# Altium schematic sheet 16_BoardPowerSupplyBattery.SchDoc: BoardPowerSupplyBattery
size A3; Author: NeoExiZ; CompanyName: BUPT CPS Lab; Organization: NeoExiZ; Address1: 418, 4#Building, BUPT; Address2: No.10, Xitucheng Road; Address3: Beijing; Address4: China; Revision: vN0.1; SheetNumber: 1; SheetTotal: 2
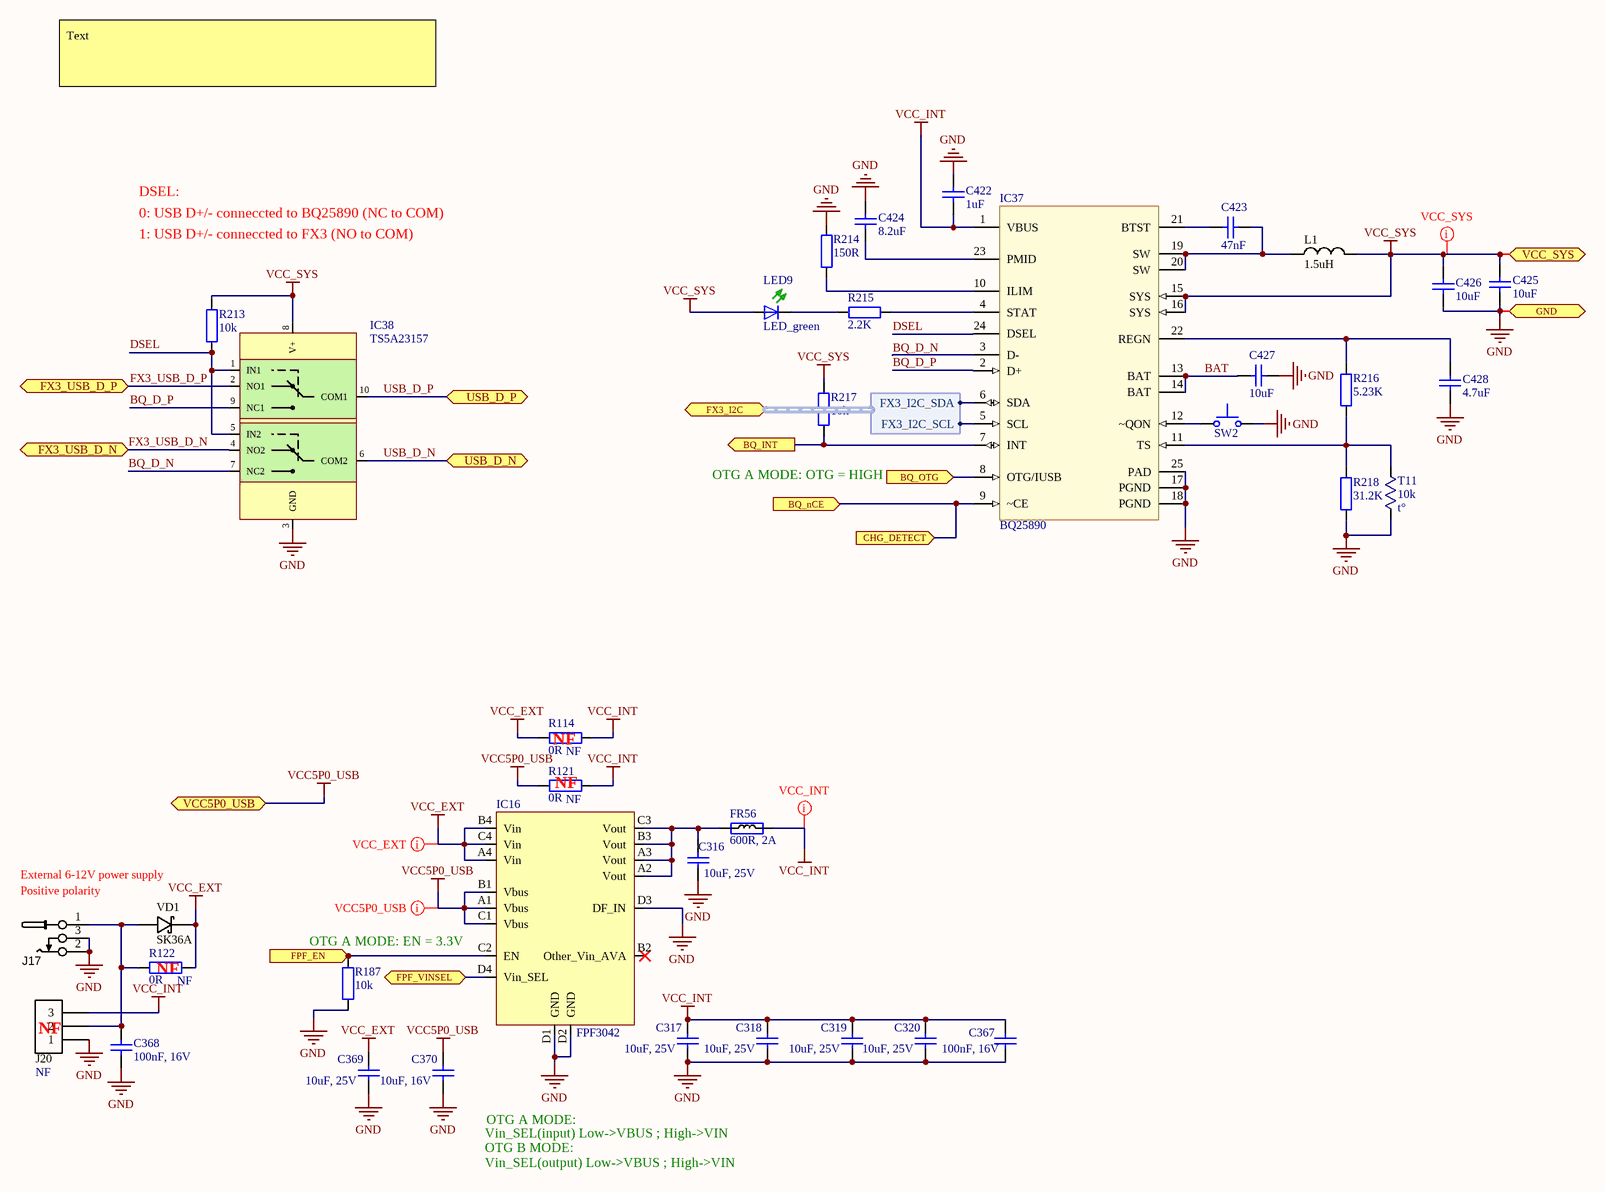
[diagram p0: 16_BoardPowerSupplyBattery.SchDoc]

## Parts
C316  10uF, 25V  [CAP0603]
C317  10uF, 25V  [CAP0603]
C318  10uF, 25V  [CAP0603]
C319  10uF, 25V  [CAP0603]
C320  10uF, 25V  [CAP0603]
C367  100nF, 16V  [CAP0402]
C368  100nF, 16V  [CAP0402]
C369  10uF, 25V  [CAP0603]
C370  10uF, 16V  [CAP0603]
C422  1uF  [CAP0402]
C423  47nF  [CAP0402]
C424  8.2uF  [CAP0402]
C425  10uF  [CAP0603]
C426  10uF  [CAP0603]
C427  10uF  [CAP0402]
C428  4.7uF  [CAP0603]
FR56  600R, 2A  [RES0805]
IC16  FPF3042  [FPF3042]
IC37  BQ25890  [WQFN-24]
IC38  TS5A23157  [TS5A23157]
J17  CONN_PWR_JACK_2.1x5.5mm  [CONN_PWR_JACK_v4]  (value not drawn)
J20  Assembly Info: NF  [HDR_1x3]  (hidden comment: Header 3x1 pin)
L1  1.5uH  [FDVE1040_TOKO_INDUCTOR]
LED9  LED_green  [LED-0603-GREEN]
R114  0R  Assembly Info: NF  [RES0402]
R121  0R  Assembly Info: NF  [RES0402]
R122  0R  Assembly Info: NF  [RES0805]
R187  10k  [RES0402]
R213  10k  [RES0402]
R214  150R  [RES0402]
R215  2.2K  [RES0402]
R216  5.23K  [RES0402]
R217  10k  [RES0402]
R218  31.2K  [RES0402]
SW2  Switch, tactile  [SW_tactile]  (value not drawn)
T11  10k  symbol: t°  [AT-2]
VD1  SK36A  [DIODE_SMB]

## Ports
BQ_INT (out), BQ_nCE (in), BQ_OTG (in), CHG_DETECT (in), FPF_EN (in), FPF_VINSEL (bidir), FX3_I2C (harness FX3_I2C), FX3_USB_D_N (bidir), FX3_USB_D_P (bidir), GND, USB_D_N (bidir), USB_D_P (bidir), VCC5P0_USB, VCC_SYS

## Harnesses
FX3_I2C: FX3_I2C_SCL, FX3_I2C_SDA

## Nets
GND: C316.1 C317.1 C318.1 C319.1 C320.1 C367.2 C368.2 C369.1 C370.1 C422.2 C424.2 C425.1 C426.1 C427.2 C428.1 IC16.D1(GND) IC16.D2(GND) IC16.D3(DF_IN) IC37.17(PGND) IC37.18(PGND) IC37.25(PAD) IC38.3(GND) J17.2 J17.3 J20.1 R187.1 R214.1 R218.1 SW2.2 T11.1 ; port GND
VCC5P0_USB: C370.2 IC16.A1(Vbus) IC16.B1(Vbus) IC16.C1(Vbus) R121.2 ; port VCC5P0_USB
VCC_EXT: C369.2 IC16.A4(Vin) IC16.B4(Vin) IC16.C4(Vin) R114.2 R122.1 VD1.K
VCC_INT: C317.2 C318.2 C319.2 C320.2 C367.1 C422.1 FR56.1 IC37.1(VBUS) J20.3 R114.1 R121.1
VCC_SYS: C425.2 C426.2 IC37.15(SYS) IC37.16(SYS) IC38.8(V+) L1.2 LED9.A R213.2 R217.2 ; port VCC_SYS
BAT: C427.1 IC37.13(BAT) IC37.14(BAT)
BQ_D_N: IC37.3(D-) IC38.7(NC2)
BQ_D_P: IC37.2(D+) IC38.9(NC1)
BQ_INT: IC37.7(INT) R217.1 ; port BQ_INT
BQ_nCE: IC37.9(~CE) ; port BQ_nCE, port CHG_DETECT
BQ_OTG: IC37.8(OTG/IUSB) ; port BQ_OTG
DSEL: IC37.24(DSEL) IC38.1(IN1) IC38.5(IN2) R213.1
FPF_EN: IC16.C2(EN) R187.2 ; port FPF_EN
FPF_VINSEL: IC16.D4(Vin_SEL) ; port FPF_VINSEL
FX3_USB_D_N: IC38.4(NO2) ; port FX3_USB_D_N
FX3_USB_D_P: IC38.2(NO1) ; port FX3_USB_D_P
USB_D_N: IC38.6(COM2) ; port USB_D_N
USB_D_P: IC38.10(COM1) ; port USB_D_P
NetC316_2: C316.2 FR56.2 IC16.A2(Vout) IC16.A3(Vout) IC16.B3(Vout) IC16.C3(Vout)
NetC368_1: C368.1 J17.1 J20.2 R122.2 VD1.A
NetC423_1: C423.1 IC37.21(BTST)
NetC423_2: C423.2 IC37.19(SW) IC37.20(SW) L1.1
NetC424_1: C424.1 IC37.23(PMID)
NetC428_2: C428.2 IC37.22(REGN) R216.2
NetIC37_4: IC37.4(STAT) R215.1
NetIC37_5: IC37.5(SCL) ; port FX3_I2C.FX3_I2C_SCL
NetIC37_6: IC37.6(SDA) ; port FX3_I2C.FX3_I2C_SDA
NetIC37_10: IC37.10(ILIM) R214.2
NetIC37_11: IC37.11(TS) R216.1 R218.2 T11.2
NetIC37_12: IC37.12(~QON) SW2.1
NetLED9_K: LED9.K(C) R215.2

Not connected (* = marked no-connect by the designer): IC16 B2(Other_Vin_AVA)*

## Layout directives
net class VCC_INT: VCC_INT
net class VCC_EXT: VCC_EXT
net class VCC5P0_USB: VCC5P0_USB
net class VCC_SYS: VCC_SYS

## Notes on the sheet
- Text
- DSEL:
- 1: USB D+/- conneccted to FX3 (NO to COM)
- 0: USB D+/- conneccted to BQ25890 (NC to COM)
- (near R217) OTG A MODE: OTG = HIGH
- (near R114) NF
- (near R121) NF
- External 6-12V power supply
- Positive polarity
- (near R187) OTG A MODE: EN = 3.3V
- (near R122) NF
- (near J20) NF
- Vin_SEL(input) Low->VBUS ; High->VIN
- OTG B MODE:
- OTG A MODE:
- Vin_SEL(output) Low->VBUS ; High->VIN
- Note:
- Project Name:
- Size:
- Date:
- Title:
- A3
- Revision:
- Time:
- Author:
- Sheet
- of
- File:

## Library data of the parts
C316-C320 C369 = Cap_0603: Manufacturer: Murata Electronics North America; Manufacturer Part Number: GRM188R61E106MA73D; Part Description: 10µF ±20% 25V X5R Ceramic Capacitor -55°C ~ 85°C Surface Mount, MLCC 0603 (1608 Metric) 0.063" L x 0.031" W (1.60mm x 0.80mm); Capacitance: 10µF; Tolerance: ±20%; Temperature Coefficient: X5R; Supplier 1: Digi-Key; Supplier Part Number 1: 490-7202-2-ND; Category: Capacitors; RoHS: RoHS Compliant; Packaging: Tape & Reel (TR); Voltage - Rated: 25V; Mounting Type: Surface Mount, MLCC; Operating Temperature: -55°C ~ 85°C; Applications: General Purpose; Ratings: -; Package / Case: 0603 (1608 Metric); Size / Dimension: 0.063" L x 0.031" W (1.60mm x 0.80mm); Height - Seated (Max): -; Thickness (Max): 0.031" (0.80mm); Lead Spacing: -; Features: -; Lead Style: -; value: 10uF, 25V
C367 C368 = Cap_0402: Manufacturer: Murata Electronics; Manufacturer Part Number: GRM155R71C104KA88D; Part Description: 0.10µF ±10% 16V X7R Ceramic Capacitor -55°C ~ 125°C Surface Mount, MLCC 0402 (1005 Metric) 0.039" L x 0.020" W (1.00mm x 0.50mm); Tolerance: 10 %; Type: General Purpose MLCC; Capacitance: 0.1 uF; Case Length: 1 mm; Dielectric: X7R; Case Height: 0.5 mm; Temperature Coefficient / Code: +/- 15 %; Value: 100nF, 16V; Supplier 1: Mouser; Supplier Part Number 1: 81-GRM155R71C104KA88; Case Code - in: 0402; RoHS: RoHS Compliant; Operating Temperature Range: - 55 C to + 125 C; Series: GRM; Termination Style: SMD/SMT; Package / Case: 0402 (1005 metric); Voltage Rating DC: 16 V; Maximum Operating Temperature: + 125 C; Case Code - mm: 1005; Minimum Operating Temperature: - 55 C; Product Category: Low & Medium Capacitance SMD Ceramic Chip Capacitors; Packaging: Reel; Product: General Type MLCCs; Category: Multilayer Ceramic Capacitors MLCC - SMD/SMT; Brand: Murata Electronics; Case Width: 0.5 mm; RoHS - Mouser: Y; Standard Pack Qty: 10000; Minimum Order Quantity: 1; Reeling: True; Manufacturer Part Number 1: GRM155R71C104KA88D
C370 = Cap_0603: Manufacturer: Yageo; Manufacturer Part Number 1: GRM188R61C106MA73D; Part Description: 10µF ±20% 16V X5R Ceramic Capacitor -55°C ~ 85°C Surface Mount, MLCC 0603 (1608 Metric) 0.063" L x 0.031" W (1.60mm x 0.80mm); Temperature Coefficient: X5R; Capacitance: 10µF; Tolerance: ±20%; Value: 10uF, 16V; Supplier 1: Digi-Key; Supplier Part Number 1: 490-7201-2-ND; Category: Capacitors; Ratings: -; Features: -; Lead Style: -; Package / Case: 0603 (1608 Metric); Lead Spacing: -; Applications: General Purpose; Voltage - Rated: 16V; Operating Temperature: -55°C ~ 85°C; Thickness (Max): 0.039" (1.00mm); Mounting Type: Surface Mount, MLCC; RoHS: RoHS Compliant; Size / Dimension: 0.063" L x 0.031" W (1.60mm x 0.80mm); Packaging: Tape & Reel (TR); Height - Seated (Max): -
C422-C424 C427 = Cap_0402: Value: *
C425 C426 C428 = Cap_0603
  C425 C426: Value: 10uF
  C428: Value: 4.7uF
FR56 = Ferrite: Manufacturer Part Number 1: MPZ2012S601AT000; Manufacturer: TDK Corporation; Part Description: FERRITE BEAD 600 OHM 0805 1LN; DC Resistance (DCR): 100 mOhm Max; Filter Type: Differential Mode - Single; Impedance @ Frequency: 600 Ohm @ 100MHz; Supplier 1: Digi-Key; Supplier Part Number 1: 445-2206-2-ND; Value: 600R, 2A; Category: Filters; Current Rating: 2A; Height (Max): 0.041" (1.05mm); Mounting Type: Surface Mount; Package / Case: 0805 (2012 Metric); Packaging: Tape & Reel (TR); RoHS: RoHS Compliant; Size / Dimension: 0.079" L x 0.049" W (2.00mm x 1.25mm)
IC16 = FPF3042: Manufacturer: Fairchild Semiconductor; Manufacturer Part Number 1: FPF3042UCX; Part Description: IC OR CTRLR SRC SELECT 16WLCSP; Current - Output (Max): 2.7A; Voltage - Supply: 4 V ~ 12.4 V; FET Type: N-Channel; Internal Switch(s): Yes; Current - Supply: 55µA; Ratio - Input:Output: 2:1; Supplier 1: Digi-Key; Operating Temperature: -40°C ~ 85°C; Type: Source Selector Switch; Delay Time - OFF: -; Package / Case: 16-UFBGA, WLCSP; Delay Time - ON: -; Mounting Type: Surface Mount; Applications: Handheld/Mobile Devices; Supplier Device Package: 16-WLCSP; Packaging: Cut Tape (CT); Category: Integrated Circuits (ICs); RoHS: RoHS Compliant; Supplier Part Number 1: FPF3042UCXCT-ND
IC38 = TS5A23157: TS3A5018; Manufacturer: Texas Instruments; Current - Supply: 1µA; Circuit: 2 x SPDT; On-State Resistance: 10 Ohm; Voltage Supply Source: Single Supply; Voltage - Supply, Single/Dual (±): 1.8 V ~ 5.5 V; Function: Switch; Supplier 1: Digi-Key; Category: Integrated Circuits (ICs); Supplier Device Package: 10-VSSOP; Package / Case: 10-TFSOP, 10-MSOP (0.118", 3.00mm Width); Mounting Type: Surface Mount; Supplier Part Number 1: 296-17076-1-ND
J17 = CONN_PWR_JACK_2.1x5.5mm: Power Connector, THT, 2.1mm ID, 5.5mm OD; Manufacturer Part Number 1: PJ-031DH; Manufacturer: CUI Inc.; Part Description: CON PWR JCK 1.3 X 4.2MM HIGH CUR; Internal Switch(s): Single Switch, Normally Closed; Current Rating: 3.5A; Connector Type: Jack; Gender: Male; Shielding: Unshielded; Voltage - Rated: 16VDC; Plug/Mating Plug Diameter: 1.35mm ID, 3.5mm OD; Number of Positions/Contacts: 2 Conductors, 3 Contacts; Supplier 1: Digi-Key; Supplier Part Number 1: CP-031DH-ND; Operating Temperature: -25°C ~ 85°C; Contact Material: Brass; RoHS: RoHS Compliant; Color: Black; Features: -; Housing Material: Thermoplastic; Housing Color: Black; Contact Material - Plating: Nickel; Mounting Type: Through Hole, Right Angle; Termination: Solder; Category: Connectors, Interconnects
J20 = Header3P: Header, 3-pin; Manufacturer Part Number 1: 68000-103HLF; Manufacturer: Amphenol FCI; Part Description: 3 Positions Header, Unshrouded Connector 0.100" (2.54mm) Through Hole Gold or Gold, GXT; Connector Type: Header, Unshrouded; Pitch: 0.100" (2.54mm); Number of Positions Loaded: All; Number of Positions: 3; Supplier 1: Digi-Key; Supplier Part Number 1: 609-3461-ND; Features: -; Fastening Type: -; Contact Finish: Gold or Gold, GXT™; Contact Mating Length: 0.230" (5.84mm); Contact Type: Male Pin; RoHS: RoHS Compliant; Color: Black; Termination: Solder; Row Spacing: -; Category: Connectors, Interconnects; Mounting Type: Through Hole; Contact Finish Thickness: 30µin (0.76µm); Number of Rows: 1; Packaging: Bulk
L1 = Inductor_0603: Manufacturer: Vishay Dale; Manufacturer Part Number 1: IHLP3232DZER1R0M01; Part Description: FIXED IND 1UH 18A 5.78 MOHM SMD; value: 1uH; Tolerance: ±20%; Frequency - Test: 100kHz; DC Resistance (DCR): 5.78 mOhm Max; Inductance: 1µH; Frequency - Self Resonant: 42MHz; Shielding: Shielded; Current - Saturation: 24A; Current Rating: 18A; Type: Molded; Supplier 1: Digi-Key; Supplier Part Number 1: 541-1371-6-ND; Supplier Device Package: -; Packaging: Digi-Reel®; Height - Seated (Max): 0.158" (4.00mm); RoHS: RoHS Compliant; Size / Dimension: 0.340" L x 0.322" W (8.64mm x 8.18mm); Category: Inductors, Coils, Chokes; Mounting Type: Surface Mount; Material - Core: -; Package / Case: Nonstandard; Q @ Freq: -; Operating Temperature: -55°C ~ 125°C
R114 R121 = Res_0402: Manufacturer Part Number 1: RC0402JR-070RL; Manufacturer: Yageo; Part Description: RES SMD 0.0OHM JUMPER 1/16W 0402; Resistance (Ohms): 0.0; Tolerance: Jumper; Power (Watts): 0.063W, 1/16W; Value: 0R; Supplier 1: Digi-Key; Supplier Part Number 1: 311-0.0JRTR-ND; Category: Resistors; Temperature Coefficient: -; Features: Moisture Resistant; Supplier Device Package: 0402; Height: 0.016" (0.40mm); Package / Case: 0402 (1005 Metric); Operating Temperature: -55°C ~ 155°C; Size / Dimension: 0.039" L x 0.020" W (1.00mm x 0.50mm); Composition: Thick Film; Packaging: Tape & Reel (TR); Number of Terminations: 2; RoHS: RoHS Compliant
R122 = Res_0402: Manufacturer Part Number 1: CRCW08050000Z0EA; Manufacturer: Vishay Dale; Part Description: RES SMD 0.0 OHM JUMPER 1/8W 0805; Power (Watts): 0.125W, 1/8W; Resistance (Ohms): 0.0; Tolerance: Jumper; Value: 0R; Supplier 1: Digi-Key; Supplier Part Number 1: 541-0.0ATR-ND; Package / Case: 0805 (2012 Metric); Height: 0.020" (0.50mm); Packaging: Tape & Reel (TR); Operating Temperature: -55°C ~ 155°C; Temperature Coefficient: -; RoHS: RoHS Compliant; Size / Dimension: 0.079" L x 0.049" W (2.00mm x 1.25mm); Supplier Device Package: 0805 (2012 Metric); Number of Terminations: 2; Category: Resistors; Features: Automotive AEC-Q200; Composition: Thick Film
R187 R213-R218 = Res_0402: Value: *
SW2 = Button: Part Description: SWITCH TACTILE SPST-NO 0.05A 12V; Manufacturer: Omron Electronics Inc-EMC Div; Manufacturer Part Number 1: B3U-1000P; Outline: 3.00mm x 2.50mm; Actuator Type: Standard; Mechanical Life: 200,000 Cycles; Actuator Orientation: Top Actuated; Supplier 1: Digi-Key; Supplier Part Number 1: SW1020TR-ND; Category: Switches
T11 = 103AT-2: thermistor; value: 10k
VD1 = DIODE_SCHOTTKY_SOD-523F: Diode Schottky SMD SOD-523F; Manufacturer Part Number 1: SK36A-LTP; Manufacturer: Micro Commercial Co; Part Description: DIODE SCHOTTKY 60V 3A DO214AC; Current - Reverse Leakage @ Vr: 500µA @ 60V; Speed: Fast Recovery =< 500ns, > 200mA (Io); Voltage - DC Reverse (Vr) (Max): 60V; Capacitance @ Vr, F: 250pF @ 4V, 1MHz; Voltage - Forward (Vf) (Max) @ If: 750mV @ 3A; Current - Average Rectified (Io): 3A; Supplier 1: Digi-Key; Supplier Part Number 1: SK36A-LTPMSCT-ND; Package / Case: DO-214AC, SMA; Reverse Recovery Time (trr): -; Diode Type: Schottky; Category: Discrete Semiconductor Products; Mounting Type: Surface Mount; RoHS: RoHS Compliant; Packaging: Cut Tape (CT); Operating Temperature - Junction: -50°C ~ 125°C; Supplier Device Package: DO-214AC (SMA)
IC37 = BQ25890: footprint: WQFN-N24